# Altium schematic sheet I2C Sensor Network.SchDoc: I2C Sensor Network
size A4; SheetNumber: 28; SheetTotal: 37
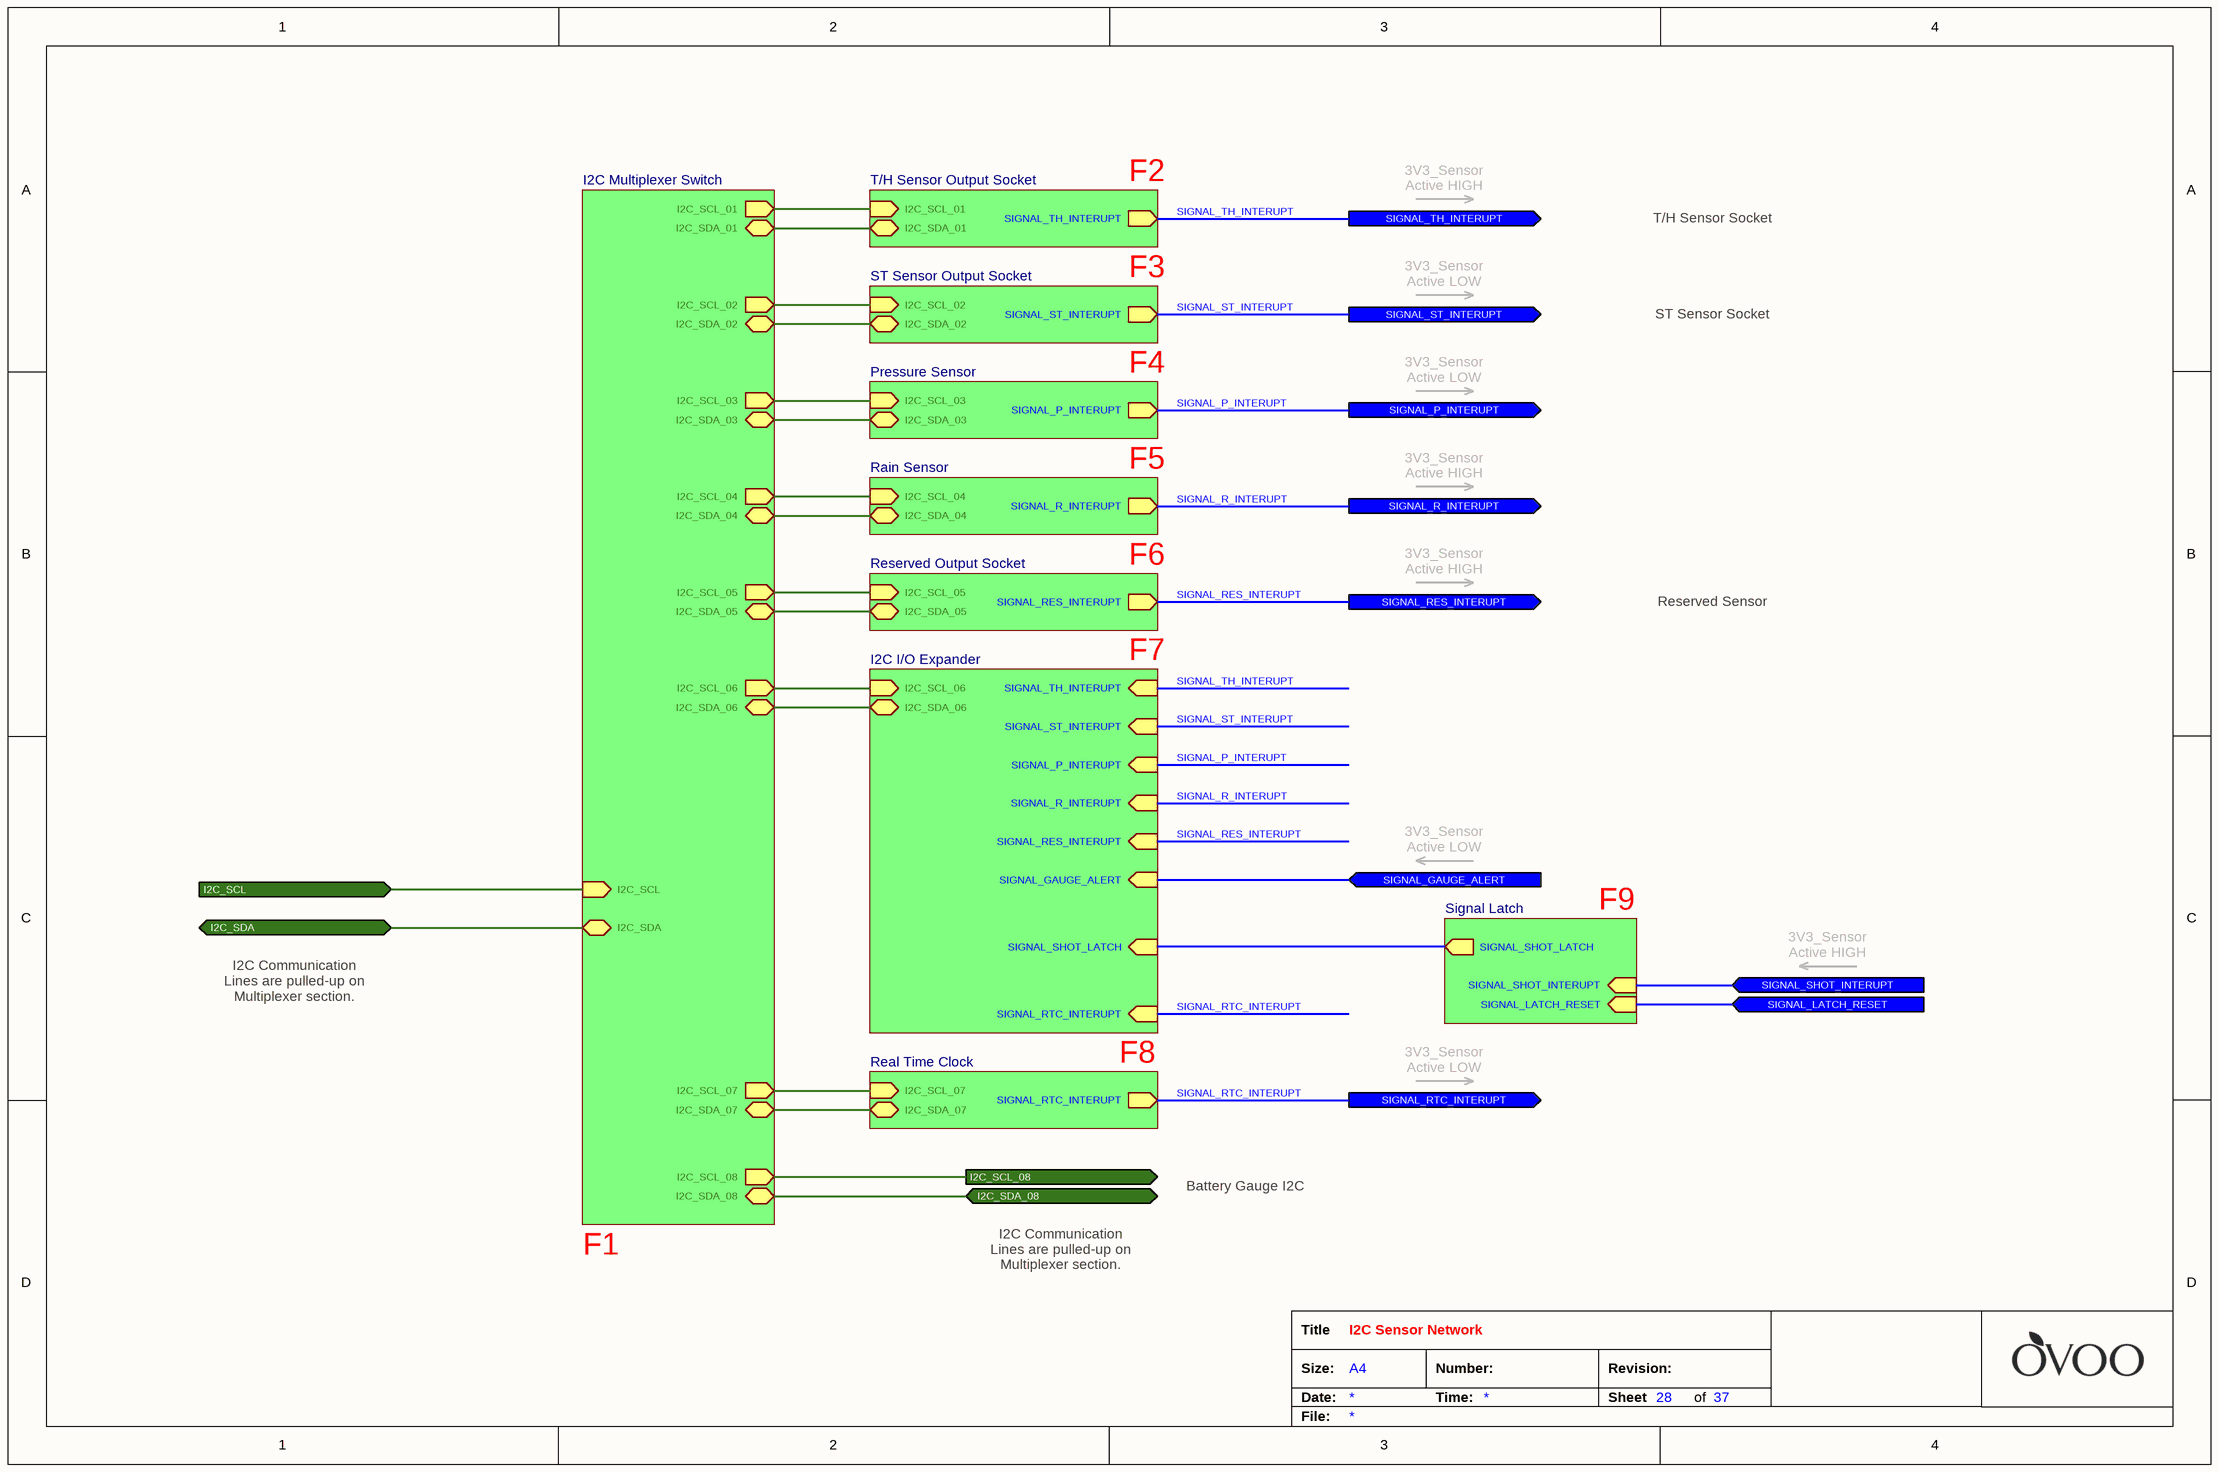
[diagram p0: I2C Sensor Network.SchDoc]

## Sub-sheets
I2C I/O Expander = I2C IO Expander.SchDoc: I2C_SCL_06 (in), SIGNAL_R_INTERUPT (in), I2C_SDA_06 (bidir), SIGNAL_RES_INTERUPT (in), SIGNAL_P_INTERUPT (in), SIGNAL_ST_INTERUPT (in), SIGNAL_TH_INTERUPT (in), SIGNAL_GAUGE_ALERT (in), SIGNAL_RTC_INTERUPT (in), SIGNAL_SHOT_LATCH (in)
I2C Multiplexer Switch = I2C Multiplexer.SchDoc: I2C_SDA_02 (bidir), I2C_SCL_07 (out), I2C_SCL (in), I2C_SCL_01 (out), I2C_SDA_06 (bidir), I2C_SCL_03 (out), I2C_SCL_05 (out), I2C_SCL_04 (out), I2C_SDA_05 (bidir), I2C_SDA_08 (bidir), I2C_SDA_01 (bidir), I2C_SDA_03 (bidir), I2C_SDA_04 (bidir), I2C_SCL_08 (out), I2C_SCL_02 (out), I2C_SDA_07 (bidir), I2C_SDA (bidir), I2C_SCL_06 (out)
Pressure Sensor = Pressure Sensor.SchDoc: SIGNAL_P_INTERUPT (out), I2C_SCL_03 (in), I2C_SDA_03 (bidir)
Rain Sensor = Capacitive Rain Sensor.SchDoc: I2C_SCL_04 (in), I2C_SDA_04 (bidir), SIGNAL_R_INTERUPT (out)
Real Time Clock = Real Time Clock.SchDoc: I2C_SDA_07 (bidir), I2C_SCL_07 (in), SIGNAL_RTC_INTERUPT (out)
Reserved Output Socket = Reserved Sensor Output Socket.SchDoc: SIGNAL_RES_INTERUPT (out), I2C_SCL_05 (in), I2C_SDA_05 (bidir)
Signal Latch = Signal Latch Logic.SchDoc: SIGNAL_SHOT_LATCH (out), SIGNAL_SHOT_INTERUPT (in), SIGNAL_LATCH_RESET (in)
ST Sensor Output Socket = ST Sensor Output Socket.SchDoc: I2C_SCL_02 (in), I2C_SDA_02 (bidir), SIGNAL_ST_INTERUPT (out)
T/H Sensor Output Socket = TH Sensor Output Socket.SchDoc: I2C_SCL_01 (in), I2C_SDA_01 (bidir), SIGNAL_TH_INTERUPT (out)

## Ports
I2C_SCL (in), I2C_SCL_08 (out), I2C_SDA (bidir), I2C_SDA_08 (bidir), SIGNAL_GAUGE_ALERT (in), SIGNAL_LATCH_RESET (in), SIGNAL_P_INTERUPT (out), SIGNAL_R_INTERUPT (out), SIGNAL_RES_INTERUPT (out), SIGNAL_RTC_INTERUPT (out), SIGNAL_SHOT_INTERUPT (in), SIGNAL_ST_INTERUPT (out), SIGNAL_TH_INTERUPT (out)

## Nets
I2C_SCL: port I2C_SCL, sheet I2C Multiplexer Switch/I2C_SCL
I2C_SCL_08: port I2C_SCL_08, sheet I2C Multiplexer Switch/I2C_SCL_08
I2C_SDA: port I2C_SDA, sheet I2C Multiplexer Switch/I2C_SDA
I2C_SDA_08: port I2C_SDA_08, sheet I2C Multiplexer Switch/I2C_SDA_08
SIGNAL_GAUGE_ALERT: port SIGNAL_GAUGE_ALERT, sheet I2C I/O Expander/SIGNAL_GAUGE_ALERT
SIGNAL_LATCH_RESET: port SIGNAL_LATCH_RESET, sheet Signal Latch/SIGNAL_LATCH_RESET
SIGNAL_P_INTERUPT: port SIGNAL_P_INTERUPT, sheet Pressure Sensor/SIGNAL_P_INTERUPT, sheet I2C I/O Expander/SIGNAL_P_INTERUPT
SIGNAL_R_INTERUPT: port SIGNAL_R_INTERUPT, sheet Rain Sensor/SIGNAL_R_INTERUPT, sheet I2C I/O Expander/SIGNAL_R_INTERUPT
SIGNAL_RES_INTERUPT: port SIGNAL_RES_INTERUPT, sheet I2C I/O Expander/SIGNAL_RES_INTERUPT, sheet Reserved Output Socket/SIGNAL_RES_INTERUPT
SIGNAL_RTC_INTERUPT: port SIGNAL_RTC_INTERUPT, sheet Real Time Clock/SIGNAL_RTC_INTERUPT, sheet I2C I/O Expander/SIGNAL_RTC_INTERUPT
SIGNAL_SHOT_INTERUPT: port SIGNAL_SHOT_INTERUPT, sheet Signal Latch/SIGNAL_SHOT_INTERUPT
SIGNAL_ST_INTERUPT: port SIGNAL_ST_INTERUPT, sheet ST Sensor Output Socket/SIGNAL_ST_INTERUPT, sheet I2C I/O Expander/SIGNAL_ST_INTERUPT
SIGNAL_TH_INTERUPT: port SIGNAL_TH_INTERUPT, sheet T/H Sensor Output Socket/SIGNAL_TH_INTERUPT, sheet I2C I/O Expander/SIGNAL_TH_INTERUPT
(unnamed): sheet I2C Multiplexer Switch/I2C_SDA_02, sheet ST Sensor Output Socket/I2C_SDA_02
(unnamed): sheet I2C Multiplexer Switch/I2C_SCL_07, sheet Real Time Clock/I2C_SCL_07
(unnamed): sheet I2C Multiplexer Switch/I2C_SCL_01, sheet T/H Sensor Output Socket/I2C_SCL_01
(unnamed): sheet I2C Multiplexer Switch/I2C_SDA_06, sheet I2C I/O Expander/I2C_SDA_06
(unnamed): sheet I2C Multiplexer Switch/I2C_SCL_03, sheet Pressure Sensor/I2C_SCL_03
(unnamed): sheet I2C Multiplexer Switch/I2C_SCL_05, sheet Reserved Output Socket/I2C_SCL_05
(unnamed): sheet I2C Multiplexer Switch/I2C_SCL_04, sheet Rain Sensor/I2C_SCL_04
(unnamed): sheet I2C Multiplexer Switch/I2C_SDA_05, sheet Reserved Output Socket/I2C_SDA_05
(unnamed): sheet I2C Multiplexer Switch/I2C_SDA_01, sheet T/H Sensor Output Socket/I2C_SDA_01
(unnamed): sheet I2C Multiplexer Switch/I2C_SDA_03, sheet Pressure Sensor/I2C_SDA_03
(unnamed): sheet I2C Multiplexer Switch/I2C_SDA_04, sheet Rain Sensor/I2C_SDA_04
(unnamed): sheet I2C Multiplexer Switch/I2C_SCL_02, sheet ST Sensor Output Socket/I2C_SCL_02
(unnamed): sheet I2C Multiplexer Switch/I2C_SDA_07, sheet Real Time Clock/I2C_SDA_07
(unnamed): sheet I2C Multiplexer Switch/I2C_SCL_06, sheet I2C I/O Expander/I2C_SCL_06
(unnamed): sheet I2C I/O Expander/SIGNAL_SHOT_LATCH, sheet Signal Latch/SIGNAL_SHOT_LATCH

## Notes on the sheet
- F2
- 3V3_Sensor
  Active HIGH
- T/H Sensor Socket
- F3
- 3V3_Sensor
  Active LOW
- ST Sensor Socket
- F4
- F5
- F6
- Reserved Sensor Socket
- F7
- F9
- I2C Communication Lines are pulled-up on Multiplexer section.
- F8
- Battery Gauge I2C
- F1
- Title
- Size:
- Date:
- A4
- Number:
- Time:
- Revision:
- Sheet
- of
- File: